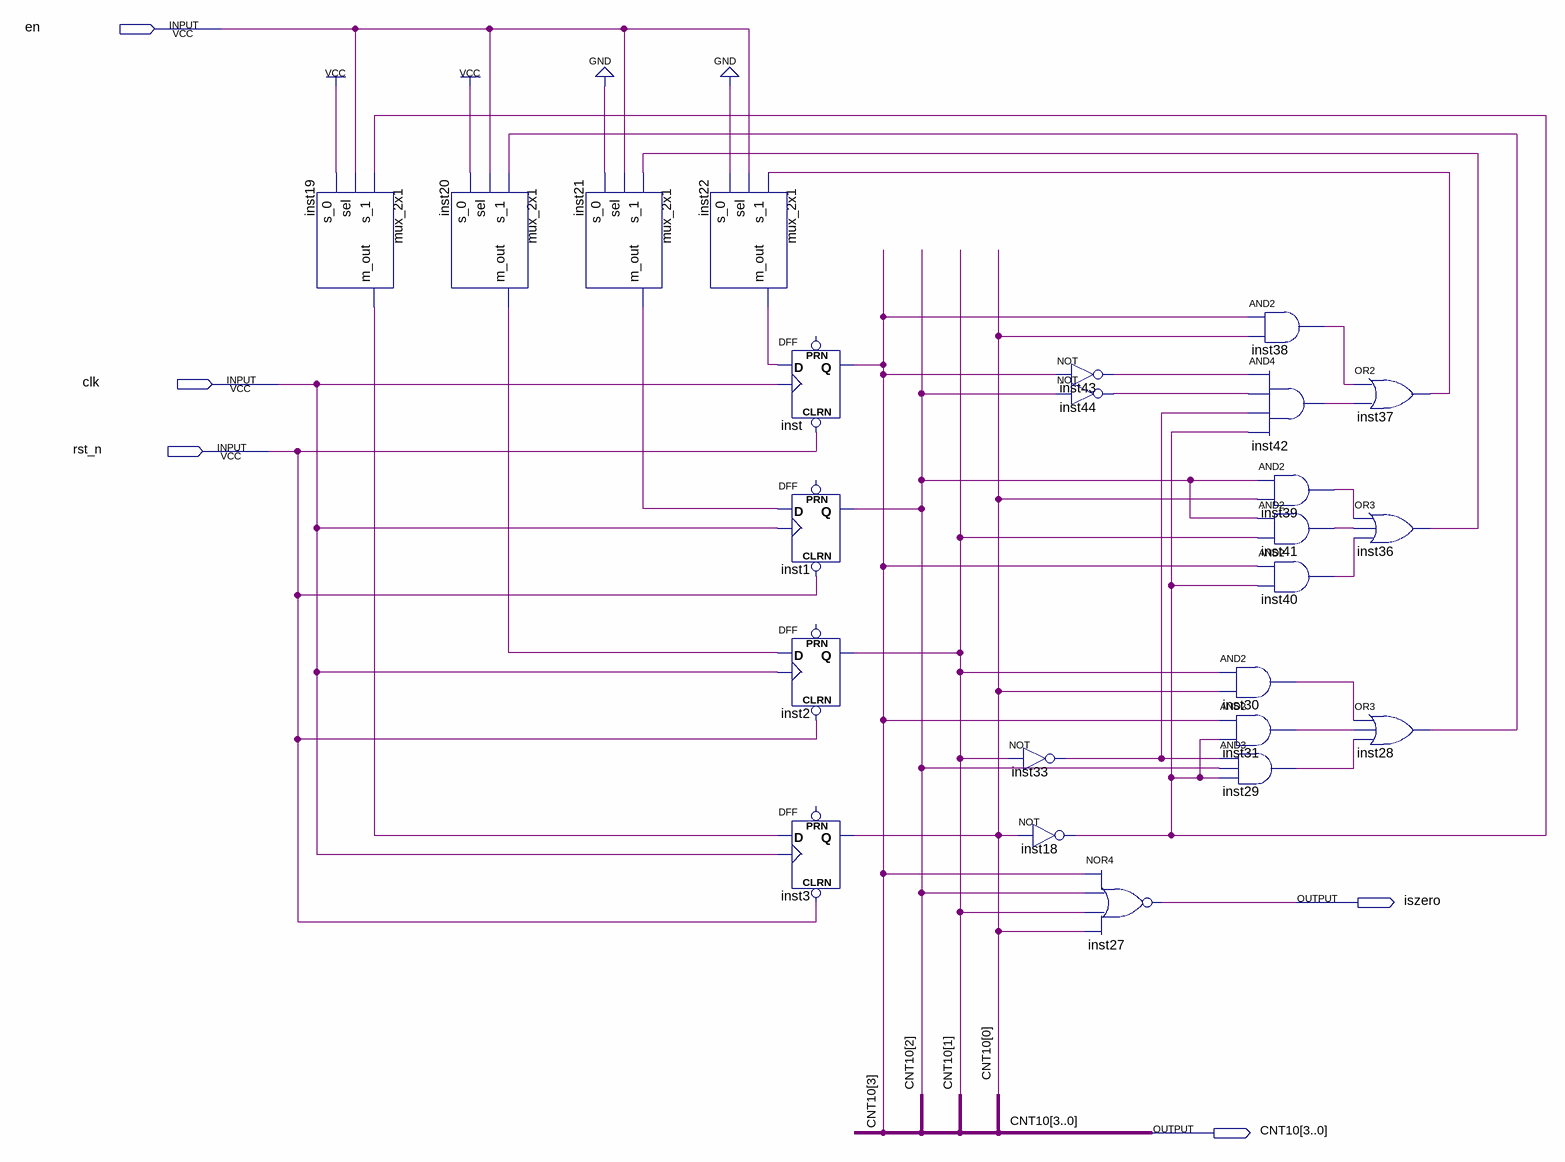
[diagram p0: schematic sheet]
// Quartus schematic test_3sec.bdf as structural Verilog: 24 symbols, 5 pins
module test_3sec (
  input  en,
  input  clk,
  input  rst_n,
  output iszero,
  output [3:0] CNT10
);

  wire inst18_out, inst19_m_out, inst20_m_out, inst21_m_out, inst22_m_out, inst28_out, inst29_out,
       inst30_out, inst31_out, inst33_out, inst36_out, inst37_out, inst38_out, inst39_out, inst40_out,
       inst41_out, inst42_out, inst43_out, inst44_out;

  mux_2x1 inst19 (.s_1(inst18_out), .sel(en), .s_0(1'b1), .m_out(inst19_m_out));
  mux_2x1 inst20 (.s_1(inst28_out), .sel(en), .s_0(1'b1), .m_out(inst20_m_out));
  mux_2x1 inst21 (.s_1(inst36_out), .sel(en), .s_0(1'b0), .m_out(inst21_m_out));
  mux_2x1 inst22 (.s_1(inst37_out), .sel(en), .s_0(1'b0), .m_out(inst22_m_out));
  DFF inst (.CLRN(rst_n), .CLK(clk), .D(inst22_m_out), .Q(CNT10[3]));  // open: PRN
  DFF inst1 (.CLRN(rst_n), .CLK(clk), .D(inst21_m_out), .Q(CNT10[2]));  // open: PRN
  DFF inst2 (.CLRN(rst_n), .CLK(clk), .D(inst20_m_out), .Q(CNT10[1]));  // open: PRN
  DFF inst3 (.CLRN(rst_n), .CLK(clk), .D(inst19_m_out), .Q(CNT10[0]));  // open: PRN
  not inst33 (inst33_out, CNT10[1]);
  not inst18 (inst18_out, CNT10[0]);
  not inst43 (inst43_out, CNT10[3]);
  not inst44 (inst44_out, CNT10[2]);
  nor inst27 (iszero, CNT10[3], CNT10[2], CNT10[1], CNT10[0]);
  and inst38 (inst38_out, CNT10[3], CNT10[0]);
  and inst42 (inst42_out, inst43_out, inst44_out, inst33_out, inst18_out);
  and inst30 (inst30_out, CNT10[1], CNT10[0]);
  and inst31 (inst31_out, CNT10[3], inst18_out);
  and inst29 (inst29_out, inst33_out, CNT10[2], inst18_out);
  and inst39 (inst39_out, CNT10[2], CNT10[0]);
  and inst41 (inst41_out, CNT10[2], CNT10[1]);
  and inst40 (inst40_out, CNT10[3], inst18_out);
  or inst37 (inst37_out, inst38_out, inst42_out);
  or inst36 (inst36_out, inst39_out, inst41_out, inst40_out);
  or inst28 (inst28_out, inst30_out, inst31_out, inst29_out);
endmodule
